# Altium project LimeSDR-XTRX_1v0.PrjPcb (part 2 of 9)

## Sheet 06_LMS7002M_RF.SchDoc: LMS7002M RF
size A3; Organization: Lime Microsystems; Address1: Surrey Tech Centre; Address2: Guildford GU2 7YG; Address3: Surrey; Address4: United Kingdom; Revision: v1.0; SheetNumber: 6; SheetTotal: 10
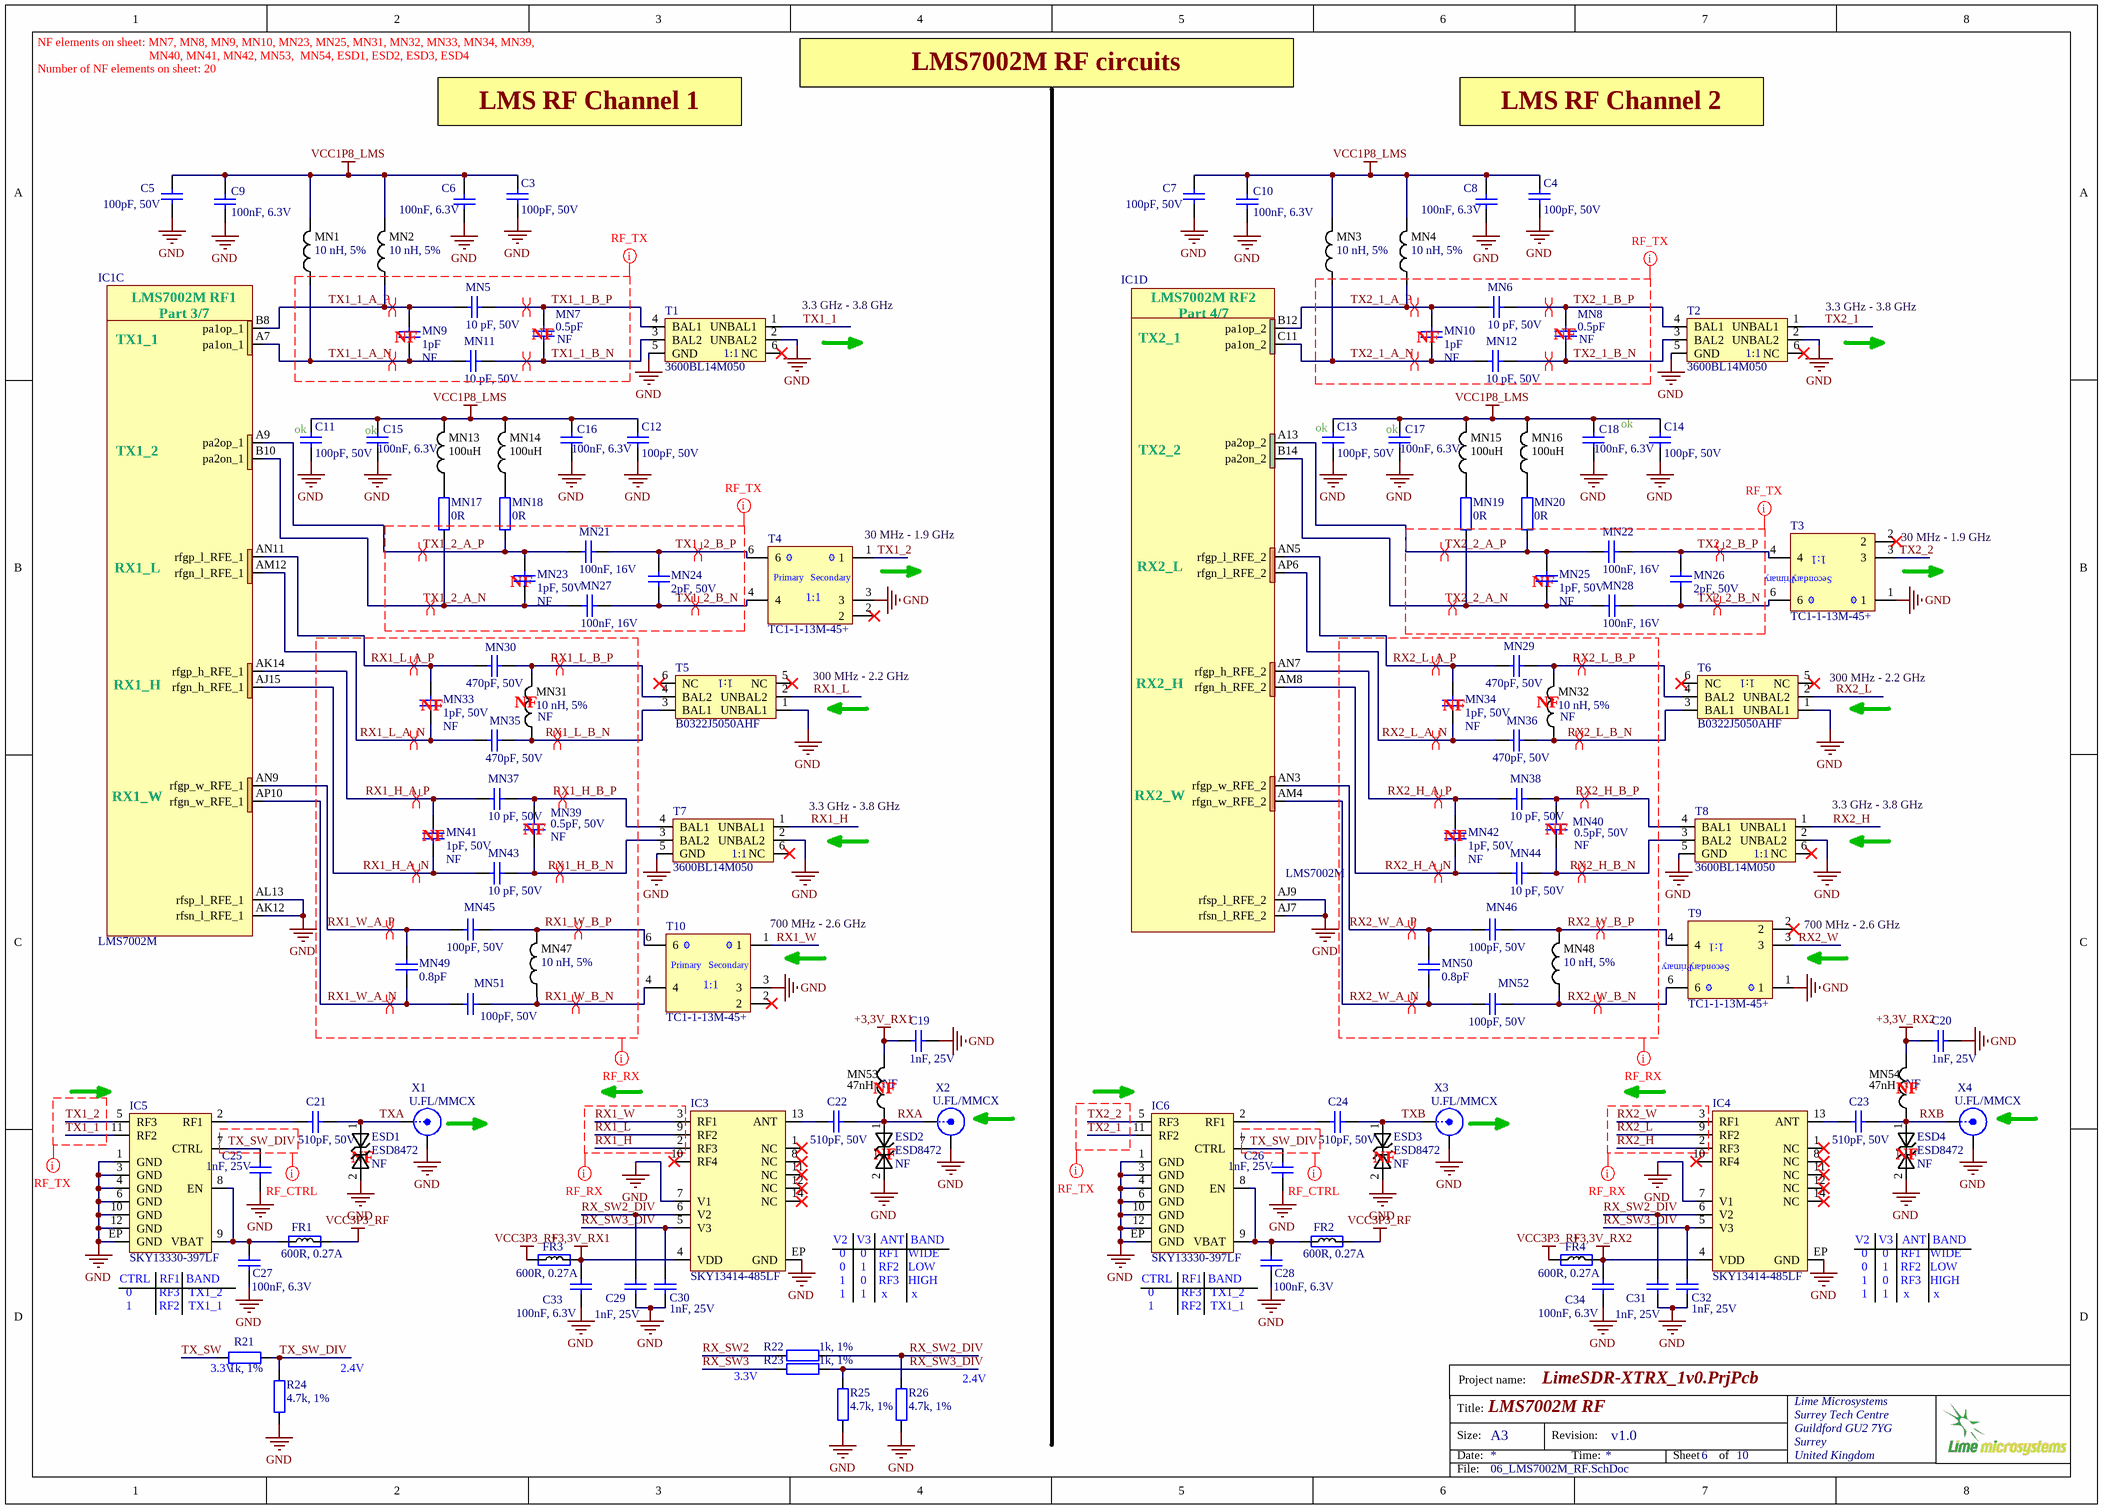
[diagram p5: 06_LMS7002M_RF.SchDoc]

### Parts
C3  100pF, 50V  [CAP0201]
C4  100pF, 50V  [CAP0201]
C5  100pF, 50V  [CAP0201]
C6  100nF, 6.3V  [CAP0201]
C7  100pF, 50V  [CAP0201]
C8  100nF, 6.3V  [CAP0201]
C9  100nF, 6.3V  [CAP0201]
C10  100nF, 6.3V  [CAP0201]
C11  100pF, 50V  [CAP0201]
C12  100pF, 50V  [CAP0201]
C13  100pF, 50V  [CAP0201]
C14  100pF, 50V  [CAP0201]
C15  100nF, 6.3V  [CAP0201]
C16  100nF, 6.3V  [CAP0201]
C17  100nF, 6.3V  [CAP0201]
C18  100nF, 6.3V  [CAP0201]
C19  1nF, 25V  [CAP0201]
C20  1nF, 25V  [CAP0201]
C21  510pF, 50V  [CAP0402]
C22  510pF, 50V  [CAP0402]
C23  510pF, 50V  [CAP0402]
C24  510pF, 50V  [CAP0402]
C25  1nF, 25V  [CAP0201]
C26  1nF, 25V  [CAP0201]
C27  100nF, 6.3V  [CAP0201]
C28  100nF, 6.3V  [CAP0201]
C29  1nF, 25V  [CAP0201]
C30  1nF, 25V  [CAP0201]
C31  1nF, 25V  [CAP0201]
C32  1nF, 25V  [CAP0201]
C33  100nF, 6.3V  [CAP0201]
C34  100nF, 6.3V  [CAP0201]
ESD1  ESD8472  Assembly Info: NF  [ESD8472_X3DFN2]
ESD2  ESD8472  Assembly Info: NF  [ESD8472_X3DFN2]
ESD3  ESD8472  Assembly Info: NF  [ESD8472_X3DFN2]
ESD4  ESD8472  Assembly Info: NF  [ESD8472_X3DFN2]
FR1  600R, 0.27A  [RES0201]
FR2  600R, 0.27A  [RES0201]
FR3  600R, 0.27A  [RES0201]
FR4  600R, 0.27A  [RES0201]
IC1  LMS7002M  [LMS7002M_v5_LESS_SILK]  (parts C,D of 7)
IC3  SKY13414-485LF  [SKY13414-485LF_RF_SW_QFN14]
IC4  SKY13414-485LF  [SKY13414-485LF_RF_SW_QFN14]
IC5  SKY13330-397LF  [SKY13330-397LF_RF_SW_QFN12]
IC6  SKY13330-397LF  [SKY13330-397LF_RF_SW_QFN12]
MN1  10 nH, 5%  [RES0402]
MN2  10 nH, 5%  [RES0402]
MN3  10 nH, 5%  [RES0402]
MN4  10 nH, 5%  [RES0402]
MN5  10 pF, 50V  [CAP0402]
MN6  10 pF, 50V  [CAP0402]
MN7  0.5pF  Assembly Info: NF  [CAP0402]
MN8  0.5pF  Assembly Info: NF  [CAP0402]
MN9  1pF  Assembly Info: NF  [CAP0402]
MN10  1pF  Assembly Info: NF  [CAP0402]
MN11  10 pF, 50V  [CAP0402]
MN12  10 pF, 50V  [CAP0402]
MN13  100uH  [RES0805]
MN14  100uH  [RES0805]
MN15  100uH  [RES0805]
MN16  100uH  [RES0805]
MN17  0R  [RES0402]
MN18  0R  [RES0402]
MN19  0R  [RES0402]
MN20  0R  [RES0402]
MN21  100nF, 16V  [CAP0402]
MN22  100nF, 16V  [CAP0402]
MN23  1pF, 50V  Assembly Info: NF  [CAP0402]
MN24  2pF, 50V  [CAP0402]
MN25  1pF, 50V  Assembly Info: NF  [CAP0402]
MN26  2pF, 50V  [CAP0402]
MN27  100nF, 16V  [CAP0402]
MN28  100nF, 16V  [CAP0402]
MN29  470pF, 50V  [CAP0402]
MN30  470pF, 50V  [CAP0402]
MN31  10 nH, 5%  Assembly Info: NF  [RES0402]
MN32  10 nH, 5%  Assembly Info: NF  [RES0402]
MN33  1pF, 50V  Assembly Info: NF  [CAP0402]
MN34  1pF, 50V  Assembly Info: NF  [CAP0402]
MN35  470pF, 50V  [CAP0402]
MN36  470pF, 50V  [CAP0402]
MN37  10 pF, 50V  [CAP0402]
MN38  10 pF, 50V  [CAP0402]
MN39  0.5pF, 50V  Assembly Info: NF  [CAP0402]
MN40  0.5pF, 50V  Assembly Info: NF  [CAP0402]
MN41  1pF, 50V  Assembly Info: NF  [CAP0402]
MN42  1pF, 50V  Assembly Info: NF  [CAP0402]
MN43  10 pF, 50V  [CAP0402]
MN44  10 pF, 50V  [CAP0402]
MN45  100pF, 50V  [CAP0402]
MN46  100pF, 50V  [CAP0402]
MN47  10 nH, 5%  [RES0402]
MN48  10 nH, 5%  [RES0402]
MN49  0.8pF  [CAP0402]
MN50  0.8pF  [CAP0402]
MN51  100pF, 50V  [CAP0402]
MN52  100pF, 50V  [CAP0402]
MN53  47nH  Assembly Info: NF  [RES0402]
MN54  47nH  Assembly Info: NF  [RES0402]
R21  1k, 1%  [RES0201]
R22  1k, 1%  [RES0201]
R23  1k, 1%  [RES0201]
R24  4.7k, 1%  [RES0201]
R25  4.7k, 1%  [RES0201]
R26  4.7k, 1%  [RES0201]
T1  3600BL14M050  [3600BL14M050_balun_0603]
T2  3600BL14M050  [3600BL14M050_balun_0603]
T3  TC1-1-13M-45+  [TC1-1-13MA+_JA4220-AL_]
T4  TC1-1-13M-45+  [TC1-1-13MA+_JA4220-AL_]
T5  B0322J5050AHF  [Anaren_0805_balun_B0322J5050AHF]
T6  B0322J5050AHF  [Anaren_0805_balun_B0322J5050AHF]
T7  3600BL14M050  [3600BL14M050_balun_0603]
T8  3600BL14M050  [3600BL14M050_balun_0603]
T9  TC1-1-13M-45+  [TC1-1-13MA+_JA4220-AL_]
T10  TC1-1-13M-45+  [TC1-1-13MA+_JA4220-AL_]
X1  U.FL/MMCX  [MMCX_UFL_conn_u_v2]
X2  U.FL/MMCX  [MMCX_UFL_conn_u_v2]
X3  U.FL/MMCX  [MMCX_UFL_conn_u_v2]
X4  U.FL/MMCX  [MMCX_UFL_conn_u_v2]

### Nets
+3,3V_RX1: C19.1 C33.1 FR3.1 IC3.4(VDD) MN53.2
+3,3V_RX2: C20.1 C34.1 FR4.1 IC4.4(VDD) MN54.2
GND: C3.1 C4.1 C5.1 C6.2 C7.1 C8.2 C9.2 C10.2 C11.1 C12.1 C13.1 C14.1 C15.2 C16.2 C17.2 C18.2 C19.2 C20.2 C25.2 C26.2 C27.2 C28.2 C29.2 C30.2 C31.2 C32.2 C33.2 C34.2 ESD1.2 ESD2.2 ESD3.2 ESD4.2 IC1.AJ7(rfsn_l_RFE_2) IC1.AJ9(rfsp_l_RFE_2) IC1.AK12(rfsn_l_RFE_1) IC1.AL13(rfsp_l_RFE_1) IC3.7(V1) IC3.EP(GND) IC4.7(V1) IC4.EP(GND) IC5.1(GND) IC5.3(GND) IC5.4(GND) IC5.6(GND) IC5.10(GND) IC5.12(GND) IC5.EP(GND) IC6.1(GND) IC6.3(GND) IC6.4(GND) IC6.6(GND) IC6.10(GND) IC6.12(GND) IC6.EP(GND) R24.2 R25.2 R26.2 T1.2(UNBAL2) T1.5(GND) T2.2(UNBAL2) T2.5(GND) T3.1 T4.3 T5.1(UNBAL1) T6.1(UNBAL1) T7.2(UNBAL2) T7.5(GND) T8.2(UNBAL2) T8.5(GND) T9.1 T10.3 X1.2(Y) X2.2(Y) X3.2(Y) X4.2(Y)
VCC1P8_LMS: C3.2 C4.2 C5.2 C6.1 C7.2 C8.1 C9.1 C10.1 C11.2 C12.2 C13.2 C14.2 C15.1 C16.1 C17.1 C18.1 MN1.2 MN2.2 MN3.2 MN4.2 MN13.2 MN14.2 MN15.2 MN16.2
VCC3P3_RF: FR1.1 FR2.1 FR3.2 FR4.2
RX1_H: IC3.2(RF3) T7.1(UNBAL1)
RX1_H_A_N: IC1.AJ15(rfgn_h_RFE_1) MN41.1 MN43.2
RX1_H_A_P: IC1.AK14(rfgp_h_RFE_1) MN37.2 MN41.2
RX1_H_B_N: MN39.1 MN43.1 T7.3(BAL2)
RX1_H_B_P: MN37.1 MN39.2 T7.4(BAL1)
RX1_L: IC3.9(RF2) T5.2(UNBAL2)
RX1_L_A_N: IC1.AM12(rfgn_l_RFE_1) MN33.1 MN35.2
RX1_L_A_P: IC1.AN11(rfgp_l_RFE_1) MN30.2 MN33.2
RX1_L_B_N: MN31.1 MN35.1 T5.3(BAL1)
RX1_L_B_P: MN30.1 MN31.2 T5.4(BAL2)
RX1_W: IC3.3(RF1) T10.1
RX1_W_A_N: IC1.AP10(rfgn_w_RFE_1) MN49.1 MN51.2
RX1_W_A_P: IC1.AN9(rfgp_w_RFE_1) MN45.2 MN49.2
RX1_W_B_N: MN47.1 MN51.1 T10.4
RX1_W_B_P: MN45.1 MN47.2 T10.6
RX2_H: IC4.2(RF3) T8.1(UNBAL1)
RX2_H_A_N: IC1.AM8(rfgn_h_RFE_2) MN42.1 MN44.2
RX2_H_A_P: IC1.AN7(rfgp_h_RFE_2) MN38.2 MN42.2
RX2_H_B_N: MN40.1 MN44.1 T8.3(BAL2)
RX2_H_B_P: MN38.1 MN40.2 T8.4(BAL1)
RX2_L: IC4.9(RF2) T6.2(UNBAL2)
RX2_L_A_N: IC1.AP6(rfgn_l_RFE_2) MN34.1 MN36.2
RX2_L_A_P: IC1.AN5(rfgp_l_RFE_2) MN29.2 MN34.2
RX2_L_B_N: MN32.1 MN36.1 T6.3(BAL1)
RX2_L_B_P: MN29.1 MN32.2 T6.4(BAL2)
RX2_W: IC4.3(RF1) T9.3
RX2_W_A_N: IC1.AM4(rfgn_w_RFE_2) MN50.1 MN52.2
RX2_W_A_P: IC1.AN3(rfgp_w_RFE_2) MN46.2 MN50.2
RX2_W_B_N: MN48.1 MN52.1 T9.6
RX2_W_B_P: MN46.1 MN48.2 T9.4
RX_SW2: R22.2
RX_SW2_DIV: C29.1 C31.1 IC3.6(V2) IC4.6(V2) R22.1 R26.1
RX_SW3: R23.2
RX_SW3_DIV: C30.1 C32.1 IC3.5(V3) IC4.5(V3) R23.1 R25.1
RXA: C22.1 ESD2.1 MN53.1 X2.1(X)
RXB: C23.1 ESD4.1 MN54.1 X4.1(X)
TX1_1: IC5.11(RF2) T1.1(UNBAL1)
TX1_1_A_N: IC1.A7(pa1on_1) MN1.1 MN9.1 MN11.2
TX1_1_A_P: IC1.B8(pa1op_1) MN2.1 MN5.1 MN9.2
TX1_1_B_N: MN7.2 MN11.1 T1.3(BAL2)
TX1_1_B_P: MN5.2 MN7.1 T1.4(BAL1)
TX1_2: IC5.5(RF3) T4.1
TX1_2_A_N: IC1.B10(pa2on_1) MN17.1 MN23.2 MN27.1
TX1_2_A_P: IC1.A9(pa2op_1) MN18.1 MN21.2 MN23.1
TX1_2_B_N: MN24.1 MN27.2 T4.4
TX1_2_B_P: MN21.1 MN24.2 T4.6
TX2_1: IC6.11(RF2) T2.1(UNBAL1)
TX2_1_A_N: IC1.C11(pa1on_2) MN3.1 MN10.1 MN12.2
TX2_1_A_P: IC1.B12(pa1op_2) MN4.1 MN6.1 MN10.2
TX2_1_B_N: MN8.2 MN12.1 T2.3(BAL2)
TX2_1_B_P: MN6.2 MN8.1 T2.4(BAL1)
TX2_2: IC6.5(RF3) T3.3
TX2_2_A_N: IC1.B14(pa2on_2) MN19.1 MN25.2 MN28.1
TX2_2_A_P: IC1.A13(pa2op_2) MN20.1 MN22.2 MN25.1
TX2_2_B_N: MN26.1 MN28.2 T3.6
TX2_2_B_P: MN22.1 MN26.2 T3.4
TX_SW: R21.2
TX_SW_DIV: C25.1 C26.1 IC5.7(CTRL) IC6.7(CTRL) R21.1 R24.1
TXA: C21.1 ESD1.1 X1.1(X)
TXB: C24.1 ESD3.1 X3.1(X)
NetC21_2: C21.2 IC5.2(RF1)
NetC22_2: C22.2 IC3.13(ANT)
NetC23_2: C23.2 IC4.13(ANT)
NetC24_2: C24.2 IC6.2(RF1)
NetC27_1: C27.1 FR1.2 IC5.8(EN) IC5.9(VBAT)
NetC28_1: C28.1 FR2.2 IC6.8(EN) IC6.9(VBAT)
NetMN13_1: MN13.1 MN17.2
NetMN14_1: MN14.1 MN18.2
NetMN15_1: MN15.1 MN19.2
NetMN16_1: MN16.1 MN20.2

Not connected (* = marked no-connect by the designer): IC3 1(NC)* 8(NC)* 10(RF4)* 11(NC)* 12(NC)* 14(NC)*; IC4 1(NC)* 8(NC)* 10(RF4)* 11(NC)* 12(NC)* 14(NC)*; T1 6(NC)*; T2 6(NC)*; T3 2*; T4 2*; T5 5(NC)* 6(NC)*; T6 5(NC)* 6(NC)*; T7 6(NC)*; T8 6(NC)*; T9 2*; T10 2*

### Layout directives
differential pair: RX1_H_A_N, RX1_H_A_P, RX1_H_B_N, RX1_H_B_P, RX1_L_A_N, RX1_L_A_P, RX1_L_B_N, RX1_L_B_P, RX1_W_A_N, RX1_W_A_P, RX1_W_B_N, RX1_W_B_P, RX2_H_A_N, RX2_H_A_P, RX2_H_B_N, RX2_H_B_P, RX2_L_A_N, RX2_L_A_P, RX2_L_B_N, RX2_L_B_P, RX2_W_A_N, RX2_W_A_P, RX2_W_B_N, RX2_W_B_P, TX1_1_A_N, TX1_1_A_P, TX1_1_B_N, TX1_1_B_P, TX1_2_A_N, TX1_2_A_P, TX1_2_B_N, TX1_2_B_P, TX2_1_A_N, TX2_1_A_P, TX2_1_B_N, TX2_1_B_P, TX2_2_A_N, TX2_2_A_P, TX2_2_B_N, TX2_2_B_P
net class RF_RX: RX1_H, RX1_H_A_N, RX1_H_A_P, RX1_H_B_N, RX1_H_B_P, RX1_L, RX1_L_A_N, RX1_L_A_P, RX1_L_B_N, RX1_L_B_P, RX1_W, RX1_W_A_N, RX1_W_A_P, RX1_W_B_N, RX1_W_B_P, RX2_H, RX2_H_A_N, RX2_H_A_P, RX2_H_B_N, RX2_H_B_P, RX2_L, RX2_L_A_N, RX2_L_A_P, RX2_L_B_N, RX2_L_B_P, RX2_W, RX2_W_A_N, RX2_W_A_P, RX2_W_B_N, RX2_W_B_P
net class RF_TX: TX1_1, TX1_1_A_N, TX1_1_A_P, TX1_1_B_N, TX1_1_B_P, TX1_2, TX1_2_A_N, TX1_2_A_P, TX1_2_B_N, TX1_2_B_P, TX2_1, TX2_1_A_N, TX2_1_A_P, TX2_1_B_N, TX2_1_B_P, TX2_2, TX2_2_A_N, TX2_2_A_P, TX2_2_B_N, TX2_2_B_P
net class RF_CTRL: TX_SW_DIV

### Notes on the sheet
- NF elements on sheet: MN7, MN8, MN9, MN10, MN23, MN25, MN31, MN32, MN33, MN34, MN39,
- Number of NF elements on sheet: 20
- MN40, MN41, MN42, MN53,  MN54, ESD1, ESD2, ESD3, ESD4
- LMS7002M RF circuits
- LMS RF Channel 1
- LMS RF Channel 2
- (near T1) 3.3 GHz - 3.8 GHz
- (near T2) 3.3 GHz - 3.8 GHz
- (near MN9) NF
- (near MN7) NF
- (near MN10) NF
- (near MN8) NF
- (near C11) ok
- (near C15) ok
- (near C13) ok
- (near C17) ok
- ok
- (near MN23) NF
- (near T4) 30 MHz - 1.9 GHz
- (near MN25) NF
- (near T3) 30 MHz - 1.9 GHz
- (near MN33) NF
- (near MN31) NF
- 300 MHz - 2.2 GHz
- (near MN34) NF
- (near MN32) NF
- (near T6) 300 MHz - 2.2 GHz
- (near MN41) NF
- (near MN39) NF
- (near T7) 3.3 GHz - 3.8 GHz
- (near MN42) NF
- (near MN40) NF
- (near T8) 3.3 GHz - 3.8 GHz
- (near T10) 700 MHz - 2.6 GHz
- (near T9) 700 MHz - 2.6 GHz
- (near MN53) NF
- (near MN54) NF
- (near ESD1) NF
- (near ESD2) NF
- (near ESD3) NF
- (near ESD4) NF
- V2   V3   ANT  BAND
- 0     0    RF1   WIDE
- CTRL   RF1  BAND
- (near C27) 0         RF3   TX1_2
- 1         RF2   TX1_1
- 0     1    RF2   LOW
- 1     0    RF3   HIGH
- 1     1     x        x
- (near C28) 0         RF3   TX1_2
- (near C28) 1         RF2   TX1_1
- (near IC4) 0     1    RF2   LOW
- (near R21) 3.3V
- 2.4V
- 3.3V
- (near R26) 2.4V
- Project name:
- Title:
- Size:
- Date:
- A3
- Revision:
- Time:
- Sheet
- of
- File:
- (in symbol LMS7002Mr4, part C) LMS7002M RF1; Part 3/7; TX1_1; TX1_2; RX1_L; RX1_H; RX1_W
- (in symbol LMS7002Mr4, part D) LMS7002M RF2; Part 4/7; TX2_1; TX2_2; RX2_L; RX2_H; RX2_W
- (in symbol TC1-1-13M+) 1:1; Primary; Secondary

### Library data of the parts
C3 = Cap_0402: Part Description: 100 pF ±5% 50V Ceramic Capacitor C0G, NP0 0201 (0603 Metric); Manufacturer: TDK; Manufacturer Part Number 1: C0603C0G1H101J030BA; Description: C Series 0201 100 pF 50 V ±5 % Tolerance C0G SMT Multilayer Ceramic Capacitor; Dielectric Material: Ceramic; Tolerance: 5%; Dielectric: C0G; Insulation Resistance: 10GR; Value: 100pF, 50V; Supplier 1: Digi-Key; Supplier Part Number 1: 445-1786-1-ND; Stock 1: 367528; Pricing 1: 1=0,10000, 10=0,06000, 50=0,03280, 100=0,02670, 500=0,01908, 1000=0,01500, 2500=0,01364, 5000=0,01254 (USD); RoHS: Yes; Mount: Surface Mount; Case/Package: 0201; Number of Pins: 2; Case Code (Metric): 0603; Case Code (Imperial): 0201; Weight: 6E-06oz; Min Operating Temperature: -55°C; Max Operating Temperature: 125°C; Package Quantity: 1; Capacitance: 100pF; Voltage Rating: 50V; Packaging: Tape and Reel; Voltage Rating (DC): 50V; Termination: SMD/SMT; Voltage: 50V; Series: C; Construction: Flat; Length: 0.6mm; Width: 0.012inch; Height: 0.3mm; Thickness: 0.013inch; Depth: 0.3mm; Reach SVHC Compliant: Yes; Lead Free: Lead Free; RoHS Compliant: Yes; ComponentLink1URL: https://datasheet.ciiva.com/24217/c0603c0g1h101j030ba-264106-24217425.pdf?src-supplier=Mouser; ComponentLink1Description: https://datasheet.ciiva.com/24217/c0603c0g1h101j030ba-264106-24217425.pdf?src-supplier=Mouser; ComponentLink2URL: https://datasheet.ciiva.com/16205/mlcc-commercial-general-en-16205590.pdf?src-supplier=Future+Electronics; ComponentLink2Description: https://datasheet.ciiva.com/16205/mlcc-commercial-general-en-16205590.pdf?src-supplier=Future+Electronics; ComponentLink3URL: https://datasheet.ciiva.com/6250/tdkmlcccaprange-6250351.pdf?src-supplier=Digi-Key; ComponentLink3Description: https://datasheet.ciiva.com/6250/tdkmlcccaprange-6250351.pdf?src-supplier=Digi-Key
C4 C5 C7 C11-C14 = Cap_0402: Part Description: 100 pF ±5% 50V Ceramic Capacitor C0G, NP0 0201 (0603 Metric); Manufacturer: TDK; Manufacturer Part Number 1: C0603C0G1H101J030BA; Dielectric: C0G; Dielectric Material: Ceramic; Insulation Resistance: 10GR; Tolerance: 5%; Value: 100pF, 50V; Capacitance: 100pF; Case/Package: 0201; Case Code (Imperial): 0201; Case Code (Metric): 0603; ComponentLink1Description: https://datasheet.ciiva.com/24217/c0603c0g1h101j030ba-264106-24217425.pdf?src-supplier=Mouser; ComponentLink1URL: https://datasheet.ciiva.com/24217/c0603c0g1h101j030ba-264106-24217425.pdf?src-supplier=Mouser; ComponentLink2Description: https://datasheet.ciiva.com/16205/mlcc-commercial-general-en-16205590.pdf?src-supplier=Future+Electronics; ComponentLink2URL: https://datasheet.ciiva.com/16205/mlcc-commercial-general-en-16205590.pdf?src-supplier=Future+Electronics; ComponentLink3Description: https://datasheet.ciiva.com/6250/tdkmlcccaprange-6250351.pdf?src-supplier=Digi-Key; ComponentLink3URL: https://datasheet.ciiva.com/6250/tdkmlcccaprange-6250351.pdf?src-supplier=Digi-Key; Construction: Flat; Depth: 0.3mm; Height: 0.3mm; Lead Free: Lead Free; Length: 0.6mm; Max Operating Temperature: 125°C; Min Operating Temperature: -55°C; Mount: Surface Mount; Number of Pins: 2; Package Quantity: 1; Packaging: Tape and Reel; Pricing 1: 1=0,10000, 10=0,06000, 50=0,03280, 100=0,02670, 500=0,01908, 1000=0,01500, 2500=0,01364, 5000=0,01254 (USD); Reach SVHC Compliant: Yes; RoHS: Yes; RoHS Compliant: Yes; Series: C; Stock 1: 367528; Supplier 1: Digi-Key; Supplier Part Number 1: 445-1786-1-ND; Termination: SMD/SMT; Thickness: 0.013inch; Voltage: 50V; Voltage Rating (DC): 50V; Voltage Rating: 50V; Weight: 6E-06oz; Width: 0.012inch
C6 C8-C10 C16-C18 C27 C28 C33 C34 = Cap_0402: Part Description: 100 pF ±5% 50V Ceramic Capacitor C0G, NP0 0201 (0603 Metric); Manufacturer: Samsung; Manufacturer Part Number 1: CL03A104MP3NNNC; Tolerance: 20%; Voltage Rating (DC): 10V; Value: 100nF, 6.3V; Capacitance: 100nF; Case/Package: 0201; Case Code (Imperial): 0201; Case Code (Metric): 0603; ComponentLink5Description: https://datasheet.ciiva.com/25788/cl03a104mp3nnnc-25788272.pdf?src-supplier=Digi-Key; ComponentLink5URL: https://datasheet.ciiva.com/25788/cl03a104mp3nnnc-25788272.pdf?src-supplier=Digi-Key; Length: 0.024inch; Max Operating Temperature: 85°C; Min Operating Temperature: -55°C; Mount: Surface Mount; Package Quantity: 1; Packaging: Tape and Reel; Pricing 1: 1=0,10000, 10=0,03000, 50=0,01640, 100=0,01330, 500=0,00950, 1000=0,00747, 2500=0,00679, 5000=0,00625 (USD); RoHS: Yes; RoHS Compliant: Yes; Series: CL; Stock 1: 3817176; Supplier 1: Digi-Key; Supplier Part Number 1: 1276-1321-1-ND; Thickness: 0.013inch; Voltage Rating: 10V; Width: 0.012inch
C15 = Cap_0402: Part Description: 100 pF ±5% 50V Ceramic Capacitor C0G, NP0 0201 (0603 Metric); Manufacturer: Samsung; Manufacturer Part Number 1: CL03A104MP3NNNC; Description: Cap Ceramic 0.1uF 10V X5R 20% SMD 0201 85°C Paper T/R; Tolerance: 20%; Voltage Rating: 10V; Value: 100nF, 6.3V; Supplier 1: Digi-Key; Supplier Part Number 1: 1276-1321-1-ND; Stock 1: 3817176; Pricing 1: 1=0,10000, 10=0,03000, 50=0,01640, 100=0,01330, 500=0,00950, 1000=0,00747, 2500=0,00679, 5000=0,00625 (USD); RoHS: Yes; Mount: Surface Mount; Case/Package: 0201; Case Code (Metric): 0603; Case Code (Imperial): 0201; Min Operating Temperature: -55°C; Max Operating Temperature: 85°C; Package Quantity: 1; Packaging: Tape and Reel; Capacitance: 100nF; Voltage Rating (DC): 10V; Series: CL; Length: 0.024inch; Width: 0.012inch; Thickness: 0.013inch; RoHS Compliant: Yes; ComponentLink5URL: https://datasheet.ciiva.com/25788/cl03a104mp3nnnc-25788272.pdf?src-supplier=Digi-Key; ComponentLink5Description: https://datasheet.ciiva.com/25788/cl03a104mp3nnnc-25788272.pdf?src-supplier=Digi-Key
C19 C20 C25 C26 C29-C32 = Cap_0402: Manufacturer Part Number 1: C0603X7R1E102K030BA; Manufacturer: TDK Corporation; Part Description: 1000pF ±10% 25V X7R Ceramic Capacitor -55°C ~ 125°C Surface Mount, MLCC 0201 (0603 Metric) 0.024" L x 0.012" W (0.60mm x 0.30mm); Temperature Coefficient: X7R; Tolerance: ±10%; Capacitance: 1000pF; Value: 1nF, 25V; Supplier 1: Digi-Key; Supplier Part Number 1: 445-7275-1-ND; Voltage - Rated: 25V; Features: -; Package / Case: 0201 (0603 Metric); Lead Spacing: -; Mounting Type: Surface Mount, MLCC; Lead Style: -; Height - Seated (Max): -; Operating Temperature: -55°C ~ 125°C; Size / Dimension: 0.024" L x 0.012" W (0.60mm x 0.30mm); Applications: General Purpose; Ratings: -; Thickness (Max): 0.013" (0.33mm); RoHS: RoHS Compliant; Packaging: Cut Tape (CT); Category: Capacitors
C21-C24 = Cap_0402: Manufacturer: Murata Electronics North America; Manufacturer Part Number 1: GRM1555C1H511JA01D; Part Description: 510pF ±5% 50V C0G, NP0 Ceramic Capacitor -55°C ~ 125°C Surface Mount, MLCC 0402 (1005 Metric) 0.039" L x 0.020" W (1.00mm x 0.50mm); Temperature Coefficient: C0G, NP0; Tolerance: ±5%; Value: 510pF, 50V; Supplier 1: Digi-Key; Supplier Part Number 1: 490-3237-1-ND; Height - Seated (Max): -; Features: -; Voltage - Rated: 50V; Size / Dimension: 0.039" L x 0.020" W (1.00mm x 0.50mm); Applications: General Purpose; Lead Spacing: -; Package / Case: 0402 (1005 Metric); Ratings: -; Thickness (Max): 0.022" (0.55mm); Lead Style: -; Operating Temperature: -55°C ~ 125°C; Mounting Type: Surface Mount, MLCC; Capacitance: 510pF; Category: Capacitors; RoHS: RoHS Compliant; Packaging: Cut Tape (CT)
ESD1-ESD4 = ESD8472: Manufacturer: ON Semiconductor; Manufacturer Part Number 1: ESD8472MUT5G; Part Description: TVS DIODE 5.3VWM 14VC X3DFN2; Voltage - Reverse Standoff (Typ): 5.3V (Max); Voltage - Breakdown (Min): 7V; Voltage - Clamping (Max) @ Ipp: 14V; Current - Peak Pulse (10/1000µs): 3A (8/20µs); Power Line Protection: No; Capacitance @ Frequency: 0.2pF @ 1MHz; Supplier 1: Digi-Key; RoHS: RoHS Compliant; Category: Circuit Protection; Stock 1: 2295; Pricing 1: 1=0.39, 10=0.315, 100=0.2142, 500=0.16068, 1000=0.12051 (USD); Packaging: Cut Tape (CT); Part Status: Active; Type: Zener; Power - Peak Pulse: -; Applications: Automotive, RF Antenna; Operating Temperature: -55°C ~ 150°C (TJ); Mounting Type: Surface Mount; Package / Case: 2-XFDFN; Supplier Device Package: 2-X3DFN (0.62x0.32); ComponentLink1URL: http://www.onsemi.com/pub/Collateral/ESD8472-D.PDF; ComponentLink1Description: http://www.onsemi.com/pub/Collateral/ESD8472-D.PDF; Supplier Part Number 1: ESD8472MUT5GOSCT-ND
FR1-FR4 = Ferrite: Manufacturer Part Number 1: BK0603TS601-T; Manufacturer: Taiyo Yuden; Part Description: FERRITE BEAD 600 OHM 0201 1LN; DC Resistance (DCR): 750 mOhm Max; Filter Type: Differential Mode - Single; Impedance @ Frequency: 600 Ohm @ 100MHz; Current Rating: 270mA; Value: 600R@100MHz; Supplier 1: Digi-Key; Supplier Part Number 1: 587-3277-1-ND; Size / Dimension: 0.024" L x 0.012" W (0.60mm x 0.30mm); Package / Case: 0201 (0603 Metric); Height (Max): 0.013" (0.33mm); Mounting Type: Surface Mount; Packaging: Cut Tape (CT); RoHS: RoHS Compliant; Category: Filters
IC1 = LMS7002Mr4: Schematic symbol revision 4. Default footprint - 0.31mm pad; Manufacturer: Lime Microsystems; Part Description: IC FPRF Transceiver LMS7002M; 261 pin aQFN; Supplier 1: Lime Microsystems; Supplier Part Number 1: LMS7002M; Manufacturer Part Number 1: LMS7002M
IC3 IC4 = SKY13414-485LF_RF_SW: Part Description: RF Switch IC General Purpose SP4T 3 GHz 50Ohm 14-QFN (2x2); Manufacturer: Skyworks Solutions; P1dB: 37dBm; Impedance: 50R; Throw Configuration: SP4T; IIP3: 70dBm; Supplier 1: Digi-Key; Supplier Part Number 1: 863-1582-1-ND; Manufacturer Part Number 1: SKY13414-485LF; Stock 1: 43522; Pricing 1: 1=1,35000, 10=1,20700, 25=1,14520, 100=0,94070, 250=0,87936, 500=0,77710, 1000=0,61350 (USD); RoHS: Yes; Case/Package: QFN; Min Operating Temperature: -40°C; Max Operating Temperature: 85°C; Packaging: Tape and Reel; Package Quantity: 3000; RoHS Compliant: Yes; ComponentLink1URL: https://datasheet.ciiva.com/15309/sky13414-485lf-201689g-231640-15309794.pdf?src-supplier=Mouser; ComponentLink1Description: https://datasheet.ciiva.com/15309/sky13414-485lf-201689g-231640-15309794.pdf?src-supplier=Mouser
IC5 IC6 = SKY13330-397LF_RF_SW: Part Description: RF Switch IC W-CDMA SPDT 6 GHz 50Ohm 12-QFN (2x2); Manufacturer: Skyworks Solutions; Frequency: 100MHz; Throw Configuration: SPDT; P1dB: 39dBm; Impedance: 50R; Insertion Loss: 0.65dB; Turn-Off Delay Time: 1.6us; Max Frequency: 6GHz; Supplier 1: Digi-Key; Supplier Part Number 1: 863-1643-1-ND; Manufacturer Part Number 1: SKY13330-397LF; Stock 1: 596826; Pricing 1: 1=0,99000, 10=0,88800, 25=0,84280, 100=0,69230, 250=0,64716, 500=0,57190, 1000=0,45150 (USD); RoHS: Yes; Mount: Surface Mount; Case/Package: QFN; Number of Pins: 12; Contact Plating: Tin,Matte; Weight: 0.000776oz; Min Operating Temperature: -40°C; Max Operating Temperature: 85°C; Packaging: Tape and Reel; Package Quantity: 3000; Turn-On Delay Time: 1.6us; Radiation Hardening: No; ComponentLink1URL: https://datasheet.ciiva.com/15100/getdatasheetpartid-656010-15100460.pdf?src-supplier=Verical; ComponentLink1Description: https://datasheet.ciiva.com/15100/getdatasheetpartid-656010-15100460.pdf?src-supplier=Verical
MN1-MN4 MN31 MN32 MN47 MN48 = Inductor_0603: Manufacturer: Murata; Manufacturer Part Number 1: LQW15AN10NJ00D; Part Description: RF Inductors - SMD 10 NH 5%; Core Material: Air,Ferrite; Current Rating: 500mA; Shielding: Unshielded; Q Factor: 25; Self Resonant Frequency: 5.5GHz; Inductance: 10nH; DC Resistance (DCR): 170mR; Test Frequency: 100MHz; Supplier 1: Digi-Key; Supplier Part Number 1: 490-1146-6-ND; Stock 1: 158333; Pricing 1: 1=0,16000, 10=0,14200, 25=0,12600, 50=0,10720, 100=0,09450, 250=0,08664, 500=0,07876, 1000=0,06615, 2500=0,05670 (USD); RoHS: Yes; Mount: Surface Mount; Case/Package: 0402; Weight: 2.8E-05oz; Case Code (Metric): 1005; Case Code (Imperial): 0402; Min Operating Temperature: -55°C; Max Operating Temperature: 125°C; Tolerance: 5%; Package Quantity: 10000; Packaging: Tape and Reel; Max DC Current: 500mA; Termination: SMD/SMT; Resistor Type: Wirewound; DC Current: 500mA; Series: LQW15A_00; Rated Current-Max: 500mA; Length: 1mm; Width: 0.02inch; Height: 0.5mm; Depth: 0.7mm; Radiation Hardening: No; Military Standard: Not; Lead Free: Lead Free; RoHS Compliant: Yes; ComponentLink1URL: https://datasheet.ciiva.com/11799/0900766b8090d800-11799037.pdf?src-supplier=RSComponents; ComponentLink1Description: https://datasheet.ciiva.com/11799/0900766b8090d800-11799037.pdf?src-supplier=RSComponents; ComponentLink2URL: https://datasheet.ciiva.com/1042/l0075s0080lqw15a-00-1042162.pdf?src-supplier=Digi-Key; ComponentLink2Description: https://datasheet.ciiva.com/1042/l0075s0080lqw15a-00-1042162.pdf?src-supplier=Digi-Key; ComponentLink3URL: https://datasheet.ciiva.com/1042/l0075s0080lqw15a-00-1042163.pdf?src-supplier=Digi-Key; ComponentLink3Description: https://datasheet.ciiva.com/1042/l0075s0080lqw15a-00-1042163.pdf?src-supplier=Digi-Key; ComponentLink4URL: https://datasheet.ciiva.com/1042/l0075s0080lqw15a-00-1042164.pdf?src-supplier=Digi-Key; ComponentLink4Description: https://datasheet.ciiva.com/1042/l0075s0080lqw15a-00-1042164.pdf?src-supplier=Digi-Key; ComponentLink5URL: https://datasheet.ciiva.com/8508/l0075s0080lqw15a-00-8508743.pdf?src-supplier=Avnet; ComponentLink5Description: https://datasheet.ciiva.com/8508/l0075s0080lqw15a-00-8508743.pdf?src-supplier=Avnet; ComponentLink6URL: https://datasheet.ciiva.com/18089/getdatasheetpartid-110925-18089287.pdf?src-supplier=Verical; ComponentLink6Description: https://datasheet.ciiva.com/18089/getdatasheetpartid-110925-18089287.pdf?src-supplier=Verical; ComponentLink7URL: https://datasheet.ciiva.com/16210/l0075s0080lqw15a-00-16210412.pdf?src-supplier=Future+Electronics; ComponentLink7Description: https://datasheet.ciiva.com/16210/l0075s0080lqw15a-00-16210412.pdf?src-supplier=Future+Electronics
MN5 MN6 MN11 MN12 MN37 MN38 MN43 MN44 = Cap_0402: Part Description: 0.80pF ±0.1pF 50V C0G, NP0 Ceramic Capacitor -55°C ~ 125°C Surface Mount, MLCC 0402 (1005 Metric) 0.039" L x 0.020" W (1.00mm x 0.50mm); Manufacturer: Walsin Technologies; Manufacturer Part Number 1: 0402N100D500CT; Capacitance: 10pF; Dielectric: C0G; Applications: General Purpose; Supplier 1: Digi-Key; Supplier Part Number 1: 1292-0402N100D500CT-ND; Stock 1: 66767; Pricing 1: 1=0,10000, 10=0,01200, 50=0,00660, 100=0,00540, 500=0,00388, 1000=0,00306, 2500=0,00278, 5000=0,00256 (USD); RoHS: Yes; Case/Package: 0402; Case Code (Metric): 1005; Case Code (Imperial): 0402; Min Operating Temperature: -55°C; Max Operating Temperature: 125°C; Packaging: Tape and Reel; Voltage Rating (DC): 50V; Voltage Rating: 50V; RoHS Compliant: Yes; ComponentLink1URL: http://www.farnell.com/datasheets/2340522.pdf?src-supplier=Farnell; ComponentLink1Description: http://www.farnell.com/datasheets/2340522.pdf?src-supplier=Farnell; ComponentLink2URL: http://www.farnell.com/datasheets/1958513.pdf?src-supplier=Element14; ComponentLink2Description: http://www.farnell.com/datasheets/1958513.pdf?src-supplier=Element14
MN7 MN8 = Cap_0402: Manufacturer: Yageo; Manufacturer Part Number 1: CC0402CRNPO9BNR50; Part Description: 0.50pF ±0.25pF 50V C0G, NP0 Ceramic Capacitor -55°C ~ 125°C Surface Mount, MLCC 0402 (1005 Metric) 0.039" L x 0.020" W (1.00mm x 0.50mm); Capacitance: 0.50pF; Voltage - Rated: 50V; Temperature Coefficient: C0G, NP0; Tolerance: ±0.25pF; Value: 0.5pF; Supplier 1: Digi-Key; Supplier Part Number 1: 311-1001-1-ND; RoHS: RoHS Compliant; Thickness (Max): 0.022" (0.55mm); Features: -; Height - Seated (Max): -; Lead Spacing: -; Applications: General Purpose; Packaging: Cut Tape (CT); Ratings: -; Size / Dimension: 0.039" L x 0.020" W (1.00mm x 0.50mm); Lead Style: -; Mounting Type: Surface Mount, MLCC; Operating Temperature: -55°C ~ 125°C; Package / Case: 0402 (1005 Metric); Category: Capacitors
MN9 MN10 = Cap_0402: Manufacturer: TDK Corporation; Manufacturer Part Number 1: C1005C0G1H010B050BA; Part Description: 1pF ±0.1pF 50V C0G, NP0 Ceramic Capacitor -55°C ~ 125°C Surface Mount, MLCC 0402 (1005 Metric) 0.039" L x 0.020" W (1.00mm x 0.50mm); Voltage - Rated: 50V; Temperature Coefficient: C0G, NP0; Tolerance: ±0.1pF; Value: 1pF; Supplier 1: Digi-Key; Supplier Part Number 1: 445-4854-6-ND; Size / Dimension: 0.039" L x 0.020" W (1.00mm x 0.50mm); Lead Spacing: -; Operating Temperature: -55°C ~ 125°C; Thickness (Max): 0.022" (0.55mm); Package / Case: 0402 (1005 Metric); Features: -; Lead Style: -; Applications: General Purpose; Height - Seated (Max): -; Capacitance: 1pF; RoHS: RoHS Compliant; Mounting Type: Surface Mount, MLCC; Packaging: Digi-Reel®; Ratings: -; Category: Capacitors
MN13-MN16 = Inductor_0603: Manufacturer: TDK Corporation; Manufacturer Part Number 1: MLF2012C101KT000; Part Description: FIXED IND 100UH 2MA 3.1 OHM SMD; Q @ Freq: 25 @ 1MHz; Shielding: Shielded; Current Rating: 2mA; Frequency - Self Resonant: 7MHz; Frequency - Test: 1MHz; Material - Core: Ferrite; Tolerance: ±10%; Inductance: 100µH; DC Resistance (DCR): 3.1 Ohm Max; Value: 100uH; Supplier 1: Digi-Key; Supplier Part Number 1: 445-1071-1-ND; Supplier Device Package: 0805 (2012 Metric); Size / Dimension: 0.079" L x 0.049" W (2.00mm x 1.25mm); Operating Temperature: -40°C ~ 85°C; Packaging: Cut Tape (CT); RoHS: RoHS Compliant; Current - Saturation: -; Height - Seated (Max): 0.057" (1.45mm); Package / Case: 0805 (2012 Metric); Mounting Type: Surface Mount; Type: Multilayer; Category: Inductors, Coils, Chokes
MN17-MN20 = Res_0402: Manufacturer: Yageo; Part Description: RES SMD 0.0OHM JUMPER 1/16W 0402; Manufacturer Part Number 1: RC0402JR-070RL; Power (Watts): 0.063W, 1/16W; Resistance (Ohms): 0.0; Tolerance: Jumper; Supplier 1: Digi-Key; Supplier Part Number 1: 311-0.0JRTR-ND; Composition: Thick Film; Package / Case: 0402 (1005 Metric); Category: Resistors; Value: 0R; Features: Moisture Resistant; Height: 0.016" (0.40mm); Number of Terminations: 2; Operating Temperature: -55°C ~ 155°C; Packaging: Tape & Reel (TR); RoHS: RoHS Compliant; Size / Dimension: 0.039" L x 0.020" W (1.00mm x 0.50mm); Supplier Device Package: 0402; Temperature Coefficient: -
MN21 MN22 MN27 MN28 = Cap_0402: Manufacturer: Murata Electronics; Manufacturer Part Number: GRM155R71C104KA88D; Part Description: 0.10µF ±10% 16V X7R Ceramic Capacitor -55°C ~ 125°C Surface Mount, MLCC 0402 (1005 Metric) 0.039" L x 0.020" W (1.00mm x 0.50mm); Tolerance: 10 %; Capacitance: 0.1 uF; Case Length: 1 mm; Dielectric: X7R; Case Height: 0.5 mm; Temperature Coefficient / Code: +/- 15 %; Value: 100nF, 16V; Supplier 1: Mouser; Supplier Part Number 1: 81-GRM155R71C104KA88; Case Code - in: 0402; RoHS: RoHS Compliant; Operating Temperature Range: - 55 C to + 125 C; Series: GRM; Termination Style: SMD/SMT; Package / Case: 0402 (1005 metric); Voltage Rating DC: 16 V; Type: General Purpose MLCC; Maximum Operating Temperature: + 125 C; Case Code - mm: 1005; Minimum Operating Temperature: - 55 C; Product Category: Low & Medium Capacitance SMD Ceramic Chip Capacitors; Packaging: Reel; Product: General Type MLCCs; Category: Multilayer Ceramic Capacitors MLCC - SMD/SMT; Brand: Murata Electronics; Case Width: 0.5 mm; RoHS - Mouser: Y; Standard Pack Qty: 10000; Minimum Order Quantity: 1; Reeling: True; Manufacturer Part Number 1: GRM155R71C104KA88D
MN23 MN25 MN33 MN34 MN41 MN42 = Cap_0402: Manufacturer: TDK Corporation; Manufacturer Part Number 1: C1005C0G1H010B050BA; Part Description: 1pF ±0.1pF 50V C0G, NP0 Ceramic Capacitor -55°C ~ 125°C Surface Mount, MLCC 0402 (1005 Metric) 0.039" L x 0.020" W (1.00mm x 0.50mm); Temperature Coefficient: C0G, NP0; Tolerance: ±0.1pF; Value: 1pF, 50V; Supplier 1: Digi-Key; Supplier Part Number 1: 445-4854-6-ND; Size / Dimension: 0.039" L x 0.020" W (1.00mm x 0.50mm); Lead Spacing: -; Operating Temperature: -55°C ~ 125°C; Thickness (Max): 0.022" (0.55mm); Package / Case: 0402 (1005 Metric); Features: -; Voltage - Rated: 50V; Lead Style: -; Applications: General Purpose; Height - Seated (Max): -; Capacitance: 1pF; RoHS: RoHS Compliant; Mounting Type: Surface Mount, MLCC; Packaging: Digi-Reel®; Ratings: -; Category: Capacitors
MN24 MN26 = Cap_0402: Manufacturer Part Number 1: 04025U2R0BAT2A; Manufacturer: AVX; Part Description: SMD Multilayer Ceramic Capacitor, U Series, 2 pF, ± 0.1pF, C0G / NP0, 50 V, 0402 [1005 Metric]; Product Range: U Series; Voltage Rating: 50; SVHC: No SVHC (17-Dec-2014); Capacitance Tolerance: ± 0.1; Ceramic Capacitor Case: 0402 [1005 Metric]; Capacitance: 2; Dielectric Characteristic: C0G / NP0; Value: 2pF, 50V; Supplier 1: Farnell; Supplier Part Number 1: 2332536; Operating Temperature Max: 125; RoHS: YES; Operating Temperature Min: -55; Capacitance Tolerance ±: ± 0.1; Packaging: Cut Tape; MSL: MSL 1 - Unlimited
MN29 MN30 MN35 MN36 = Cap_0402: Manufacturer Part Number: C1005C0G1H471J050BA; Manufacturer: TDK Corporation; Part Description: 470pF ±5% 50V Ceramic Capacitor C0G, NP0 0402 (1005 Metric); Tolerance: ±5%; Temperature Coefficient: C0G, NP0; Value: 470pF, 50V; Supplier 1: Digi-Key; Supplier Part Number 1: 445-2656-6-ND; Ratings: -; Package / Case: 0402 (1005 Metric); Capacitance: 470pF; Packaging: Digi-Reel®; RoHS: RoHS Compliant; Lead Style: -; Thickness (Max): 0.022" (0.55mm); Size / Dimension: 0.039" L x 0.020" W (1.00mm x 0.50mm); Lead Spacing: -; Operating Temperature: -55°C ~ 125°C; Height - Seated (Max): -; Applications: General Purpose; Mounting Type: Surface Mount, MLCC; Voltage - Rated: 50V; Category: Capacitors; Features: -; Manufacturer Part Number 1: C1005C0G1H471J050BA
MN39 MN40 = Cap_0402: Manufacturer: Yageo; Manufacturer Part Number 1: CC0402CRNPO9BNR50; Part Description: 0.50pF ±0.25pF 50V C0G, NP0 Ceramic Capacitor -55°C ~ 125°C Surface Mount, MLCC 0402 (1005 Metric) 0.039" L x 0.020" W (1.00mm x 0.50mm); Capacitance: 0.50pF; Temperature Coefficient: C0G, NP0; Tolerance: ±0.25pF; Value: 0.5pF, 50V; Supplier 1: Digi-Key; Supplier Part Number 1: 311-1001-1-ND; RoHS: RoHS Compliant; Thickness (Max): 0.022" (0.55mm); Features: -; Height - Seated (Max): -; Lead Spacing: -; Voltage - Rated: 50V; Applications: General Purpose; Packaging: Cut Tape (CT); Ratings: -; Size / Dimension: 0.039" L x 0.020" W (1.00mm x 0.50mm); Lead Style: -; Mounting Type: Surface Mount, MLCC; Operating Temperature: -55°C ~ 125°C; Package / Case: 0402 (1005 Metric); Category: Capacitors
MN45 MN46 MN51 MN52 = Cap_0402: Manufacturer Part Number 1: CC0402JRNPO9BN101; Manufacturer: Yageo; Part Description: 100pF ±5% 50V C0G, NP0 Ceramic Capacitor -55°C ~ 125°C Surface Mount, MLCC 0402 (1005 Metric) 0.039" L x 0.020" W (1.00mm x 0.50mm); Tolerance: ±5%; Temperature Coefficient: C0G, NP0; Value: 100pF, 50V; Capacitance: 100pF; Thickness (Max): 0.022" (0.55mm); Size / Dimension: 0.039" L x 0.020" W (1.00mm x 0.50mm); RoHS: RoHS Compliant; Ratings: -; Package / Case: 0402 (1005 Metric); Mounting Type: Surface Mount, MLCC; Height - Seated (Max): -; Features: -; Lead Spacing: -; Voltage - Rated: 50V; Operating Temperature: -55°C ~ 125°C; Packaging: Cut Tape (CT); Applications: General Purpose; Lead Style: -; Supplier 1: Digi-Key; Category: Capacitors; Supplier Part Number 1: 311-1024-1-ND
MN49 MN50 = Cap_0402: Manufacturer: Murata Electronics North America; Manufacturer Part Number 1: GRM1555C1HR80BA01D; Part Description: 0.80pF ±0.1pF 50V C0G, NP0 Ceramic Capacitor -55°C ~ 125°C Surface Mount, MLCC 0402 (1005 Metric) 0.039" L x 0.020" W (1.00mm x 0.50mm); Temperature Coefficient: C0G, NP0; Capacitance: 0.80pF; Voltage - Rated: 50V; Tolerance: ±0.1pF; Value: 0.8pF; Applications: General Purpose; Operating Temperature: -55°C ~ 125°C; Size / Dimension: 0.039" L x 0.020" W (1.00mm x 0.50mm); Features: -; Supplier 1: Digi-Key; Height - Seated (Max): -; Category: Capacitors; Package / Case: 0402 (1005 Metric); Mounting Type: Surface Mount, MLCC; Lead Spacing: -; Thickness (Max): 0.022" (0.55mm); RoHS: RoHS Compliant; Supplier Part Number 1: 490-6269-1-ND; Packaging: Cut Tape (CT); Ratings: -; Lead Style: -
MN53 MN54 = Inductor_0603: Manufacturer: COILCRAFT; Manufacturer Part Number: 0402HP-47NXJLU; Part Description: INDUCTOR, RF, 47NH, 5%, 2.4GHZ, SMD; Product Range:0402HP Series; Inductance:47nH; Inductance Tolerance:± 5%; High Frequency Inductor Case:0402 [1005 Metric]; Self Resonant Frequency Min:2.4GHz; DC Resistance Max:0.58ohm; DC Current Rating:420mA; SVHC: No SVHC (15-Jun-2015); Inductance Tolerance: ± 5%; High Frequency Inductor Case: 0402 [1005 Metric]; Inductance: 47; DC Resistance Max: 0.58; Self Resonant Frequency Min: 2.4; Product Range: 0402; DC Current Rating: 420; Inductor Construction: Wirewound; Supplier 1: Farnell; Supplier Part Number 1: 2285856; Packaging: Cut Tape; Inductor Case Style: 0402 [1005 Metric]; RoHS: Y-EX; value: 47nH; Manufacturer Part Number 1: 0402HP-47NXJLU
R21-R23 = Res_0402: Manufacturer: Yageo; Manufacturer Part Number 1: RC0201FR-071KL; Part Description: 1 kOhms ±1% 0.05W, 1/20W Chip Resistor 0201 (0603 Metric) Moisture Resistant Thick Film; Resistance: 1kR; Power Rating: 50mW; Voltage Rating: 25V; Temperature Coefficient: 200ppm/°C; Value: 1k, 1%; Supplier 1: Digi-Key; Supplier Part Number 1: 311-1KMDKR-ND; Stock 1: 9099863; Pricing 1: 1=0,10000, 10=0,03700, 100=0,01530, 1000=0,00685, 2500=0,00595, 5000=0,00491 (USD); RoHS: Yes; Case/Package: 0201; Case Code (Metric): 0603; Case Code (Imperial): 0201; Contact Plating: Tin,Matte; Min Operating Temperature: -55°C; Max Operating Temperature: 125°C; Package Quantity: 10000; Packaging: Tape and Reel; Tolerance: 1%; Resistor Type: Thick Film; Number of Terminations: 2; Termination: SMD/SMT; Max Power Dissipation: 50mW; Working Voltage: 25V; Features: Moisture Resistant; Series: RC; Resistance Tolerance: 1%; Technology: THICK FILM; Construction: Rectangular; Length: 0.024inch; Width: 0.012inch; Height: 0.01inch; Depth: 0.3mm; Radiation Hardening: No; Military Standard: Not; Lead Free: Lead Free; RoHS Compliant: Yes; ComponentLink1URL: https://datasheet.ciiva.com/7672/1563626-7672204.pdf?src-supplier=Element14; ComponentLink1Description: https://datasheet.ciiva.com/7672/1563626-7672204.pdf?src-supplier=Element14; ComponentLink2URL: https://datasheet.ciiva.com/22698/1563626-22698505.pdf?src-supplier=Element14; ComponentLink2Description: https://datasheet.ciiva.com/22698/1563626-22698505.pdf?src-supplier=Element14; ComponentLink3URL: https://datasheet.ciiva.com/29721/pyu-r-int-thick-7-29721196.pdf?src-supplier=Digi-Key; ComponentLink3Description: https://datasheet.ciiva.com/29721/pyu-r-int-thick-7-29721196.pdf?src-supplier=Digi-Key; ComponentLink4URL: https://datasheet.ciiva.com/29721/pyu-r-int-thick-7-29721195.pdf?src-supplier=Digi-Key; ComponentLink4Description: https://datasheet.ciiva.com/29721/pyu-r-int-thick-7-29721195.pdf?src-supplier=Digi-Key; ComponentLink5URL: https://datasheet.ciiva.com/8896/pyu-rc0201-51-rohs-l-8-8896174.pdf?src-supplier=Avnet; ComponentLink5Description: https://datasheet.ciiva.com/8896/pyu-rc0201-51-rohs-l-8-8896174.pdf?src-supplier=Avnet
R24-R26 = Res_0402: Manufacturer: Yageo; Manufacturer Part Number 1: RC0201FR-074K7L; Part Description: 4.7 kOhms ±1% 0.05W, 1/20W Chip Resistor 0201 (0603 Metric) Moisture Resistant Thick Film; Resistance: 4.7kR; Power Rating: 50mW; Voltage Rating: 25V; Temperature Coefficient: 200ppm/°C; Value: 4.7k, 1%; ComponentLink1URL: https://datasheet.ciiva.com/5924/1563626-5924912.pdf?src-supplier=Farnell; ComponentLink1Description: https://datasheet.ciiva.com/5924/1563626-5924912.pdf?src-supplier=Farnell; ComponentLink2URL: https://datasheet.ciiva.com/22661/1563626-22661319.pdf?src-supplier=Element14; ComponentLink2Description: https://datasheet.ciiva.com/22661/1563626-22661319.pdf?src-supplier=Element14; ComponentLink3URL: https://datasheet.ciiva.com/7672/1563626-7672202.pdf?src-supplier=Element14; ComponentLink3Description: https://datasheet.ciiva.com/7672/1563626-7672202.pdf?src-supplier=Element14; ComponentLink4URL: https://datasheet.ciiva.com/2493/pyu-r-int-thick-7-2493785.pdf?src-supplier=Digi-Key; ComponentLink4Description: https://datasheet.ciiva.com/2493/pyu-r-int-thick-7-2493785.pdf?src-supplier=Digi-Key; ComponentLink5URL: https://datasheet.ciiva.com/2493/pyu-r-int-thick-7-2493786.pdf?src-supplier=Digi-Key; ComponentLink5Description: https://datasheet.ciiva.com/2493/pyu-r-int-thick-7-2493786.pdf?src-supplier=Digi-Key; ComponentLink6URL: https://datasheet.ciiva.com/2493/pyu-r-int-thick-7-2493784.pdf?src-supplier=Digi-Key; ComponentLink6Description: https://datasheet.ciiva.com/2493/pyu-r-int-thick-7-2493784.pdf?src-supplier=Digi-Key; ComponentLink7URL: https://datasheet.ciiva.com/7672/1563626-7672233.pdf?src-supplier=Element14; ComponentLink7Description: https://datasheet.ciiva.com/7672/1563626-7672233.pdf?src-supplier=Element14; ComponentLink8URL: https://datasheet.ciiva.com/2493/pyu-r-int-thick-7-2493812.pdf?src-supplier=Digi-Key; ComponentLink8Description: https://datasheet.ciiva.com/2493/pyu-r-int-thick-7-2493812.pdf?src-supplier=Digi-Key; ComponentLink9URL: https://datasheet.ciiva.com/2493/pyu-r-int-thick-7-2493813.pdf?src-supplier=Digi-Key; ComponentLink9Description: https://datasheet.ciiva.com/2493/pyu-r-int-thick-7-2493813.pdf?src-supplier=Digi-Key; ComponentLink10URL: https://datasheet.ciiva.com/2493/pyu-r-int-thick-7-2493811.pdf?src-supplier=Digi-Key; ComponentLink10Description: https://datasheet.ciiva.com/2493/pyu-r-int-thick-7-2493811.pdf?src-supplier=Digi-Key; ComponentLink11URL: https://datasheet.ciiva.com/8892/pyu-rc0201-51-rohs-l-8-8892942.pdf?src-supplier=Avnet; ComponentLink11Description: https://datasheet.ciiva.com/8892/pyu-rc0201-51-rohs-l-8-8892942.pdf?src-supplier=Avnet; Supplier 1: Digi-Key; Supplier Part Number 1: 311-4.70KMCT-ND; Stock 1: 6149397; Pricing 1: 1=0,10000, 10=0,03700, 100=0,01530, 1000=0,00685, 2500=0,00595, 5000=0,00491 (USD); RoHS: Yes; Case/Package: 0201; Case Code (Metric): 0603; Case Code (Imperial): 0201; Weight: 6E-06oz; Contact Plating: Tin,Matte; Size Code: 0201; Min Operating Temperature: -55°C; Max Operating Temperature: 125°C; Tolerance: 1%; Packaging: Tape and Reel; Package Quantity: 1; Resistor Type: Thick Film; Number of Terminations: 2; Termination: SMD/SMT; Max Power Dissipation: 50mW; Features: Moisture Resistant; Series: RC; Resistance Tolerance: 1%; Construction: Rectangular; Length: 0.6mm; Width: 0.012inch; Height: 0.01inch; Depth: 0.3mm; Radiation Hardening: No; Military Standard: Not; Lead Free: Lead Free; RoHS Compliant: Yes
T1 T2 T7 T8 = 3600BL14M050_balun: Part Description: Signal Conditioning 3.6GHz 1:1 BALUN; Manufacturer: Johanson; Manufacturer Part Number 1: 3600BL14M050T; Impedance: 50R; Frequency: 3.6GHz; Insertion Loss: 1.2dB; Max Frequency: 3.9GHz; Return Loss: 9.5dB; Turns Ratio: 1:1; Min Frequency: 3.3GHz; Supplier 1: Digi-Key; Supplier Part Number 1: 712-1048-1-ND; Stock 1: 41138; Pricing 1: 1=1,19000, 10=1,16900, 25=0,78280, 50=0,69680, 100=0,63840, 250=0,57280, 500=0,56086, 1000=0,40573 (USD); RoHS: Yes; Mount: Surface Mount; Case/Package: 0603; Number of Pins: 6; Case Code (Metric): 1608; Case Code (Imperial): 0603; Min Operating Temperature: -40°C; Max Operating Temperature: 85°C; Package Quantity: 1; Packaging: Tape and Reel; Termination: SMD/SMT; Resistor Type: Ceramic; Series: 3600; Length: 1.6mm; Depth: 0.8mm; Radiation Hardening: No; ComponentLink1URL: https://datasheet.ciiva.com/2788/3600bl14m050-2788852.pdf?src-supplier=Digi-Key; ComponentLink1Description: https://datasheet.ciiva.com/2788/3600bl14m050-2788852.pdf?src-supplier=Digi-Key; ComponentLink2URL: https://datasheet.ciiva.com/22694/1318325-22694755.pdf?src-supplier=Element14; ComponentLink2Description: https://datasheet.ciiva.com/22694/1318325-22694755.pdf?src-supplier=Element14; ComponentLink3URL: https://datasheet.ciiva.com/24072/balun-3600bl14m050-242434-24072532.pdf?src-supplier=Mouser; ComponentLink3Description: https://datasheet.ciiva.com/24072/balun-3600bl14m050-242434-24072532.pdf?src-supplier=Mouser
T3 T4 T9 T10 = TC1-1-13M+: Part Description: RF balun; 1:1 ratio; 3 dB bandwidth: 0.3 MHz to 3.5 GHz; 3.8mm x 3.8mm; Manufacturer: Minicircuits; Supplier 1: Minicircuits; Manufacturer Part Number 1: TC1-1-13M-45+; Supplier Part Number 1: TC1-1-13M-45+
T5 T6 = B0322J5050AHF_balun: Part Description: Signal Conditioning 300-2200MHz 50 Ohm IL=1.6dB; Manufacturer: Anaren; Impedance: 50R; Turns Ratio: 1:1; Insertion Loss: 1.6dB; Supplier 1: Mouser; Supplier Part Number 1: 620-B0322J5050AHF; Manufacturer Part Number 1: B0322J5050AHF; Stock 1: 19367; Pricing 1: 1=1,65000, 10=1,02000, 50=1,02000, 100=0,88300, 1000=0,56100, 10000=0,52800 (USD); RoHS: Yes; Mount: Surface Mount; Case/Package: 0805; Number of Pins: 6; Case Code (Metric): 2012; Case Code (Imperial): 0805; Min Operating Temperature: -55°C; Max Operating Temperature: 85°C; Package Quantity: 1; Packaging: Tape and Reel; Termination: SMD/SMT; Series: Xinger®; Length: 2.04mm; Depth: 1.29mm; RoHS Compliant: Yes; ComponentLink1URL: https://datasheet.ciiva.com/2788/b0322j5050ahf-datasheet-reva-2788996.pdf?src-supplier=Digi-Key; ComponentLink1Description: https://datasheet.ciiva.com/2788/b0322j5050ahf-datasheet-reva-2788996.pdf?src-supplier=Digi-Key; ComponentLink2URL: https://datasheet.ciiva.com/4548/b0322j5050ahf-datasheet-reva-18090-4548378.pdf?src-supplier=Mouser; ComponentLink2Description: https://datasheet.ciiva.com/4548/b0322j5050ahf-datasheet-reva-18090-4548378.pdf?src-supplier=Mouser; ComponentLink3URL: https://datasheet.ciiva.com/2788/b0322j5050ahf-2788997.pdf?src-supplier=Digi-Key; ComponentLink3Description: https://datasheet.ciiva.com/2788/b0322j5050ahf-2788997.pdf?src-supplier=Digi-Key; ComponentLink4URL: https://datasheet.ciiva.com/2788/b0322j5050ahf-2788998.pdf?src-supplier=Digi-Key; ComponentLink4Description: https://datasheet.ciiva.com/2788/b0322j5050ahf-2788998.pdf?src-supplier=Digi-Key; ComponentLink5URL: https://datasheet.ciiva.com/26819/getdatasheetpartid-573228-26819653.pdf?src-supplier=Verical; ComponentLink5Description: https://datasheet.ciiva.com/26819/getdatasheetpartid-573228-26819653.pdf?src-supplier=Verical
X1-X4 = RF_IF_connector: CONN UMC RCPT STR 50 OHM SMD; Manufacturer: Molex, LLC; Manufacturer Part Number 1: 0734120110; Part Description: Ultra Miniature Coaxial Connector Receptacle, Male Pin 50 Ohm Surface Mount Solder; Body Finish: Nickel; Body Material: Phosphor Bronze; Center Contact Material: Brass; Center Contact Plating: Gold; Connector Style: Ultra Miniature Coaxial; Connector Type: Jack, Male Pin; Contact Termination: Solder; Dielectric Material: Liquid Crystal Polymer (LCP); Frequency - Max: 6GHz; Impedance: 50 Ohm; Voltage Rating: 60V; Cable Group: -; Category: Connectors, Interconnects; Fastening Type: Snap-On; Features: -; Housing Color: Silver; Ingress Protection: -; Mounting Type: Surface Mount; Operating Temperature: -40°C ~ 90°C; Packaging: Cut Tape (CT); RoHS: RoHS Compliant; Shield Termination: Solder; Supplier 1: Digi-Key; Supplier Part Number 1: WM5587CT-ND